# EAGLE design PCB_Reflow0xPIT (EAGLE 6.5.0)
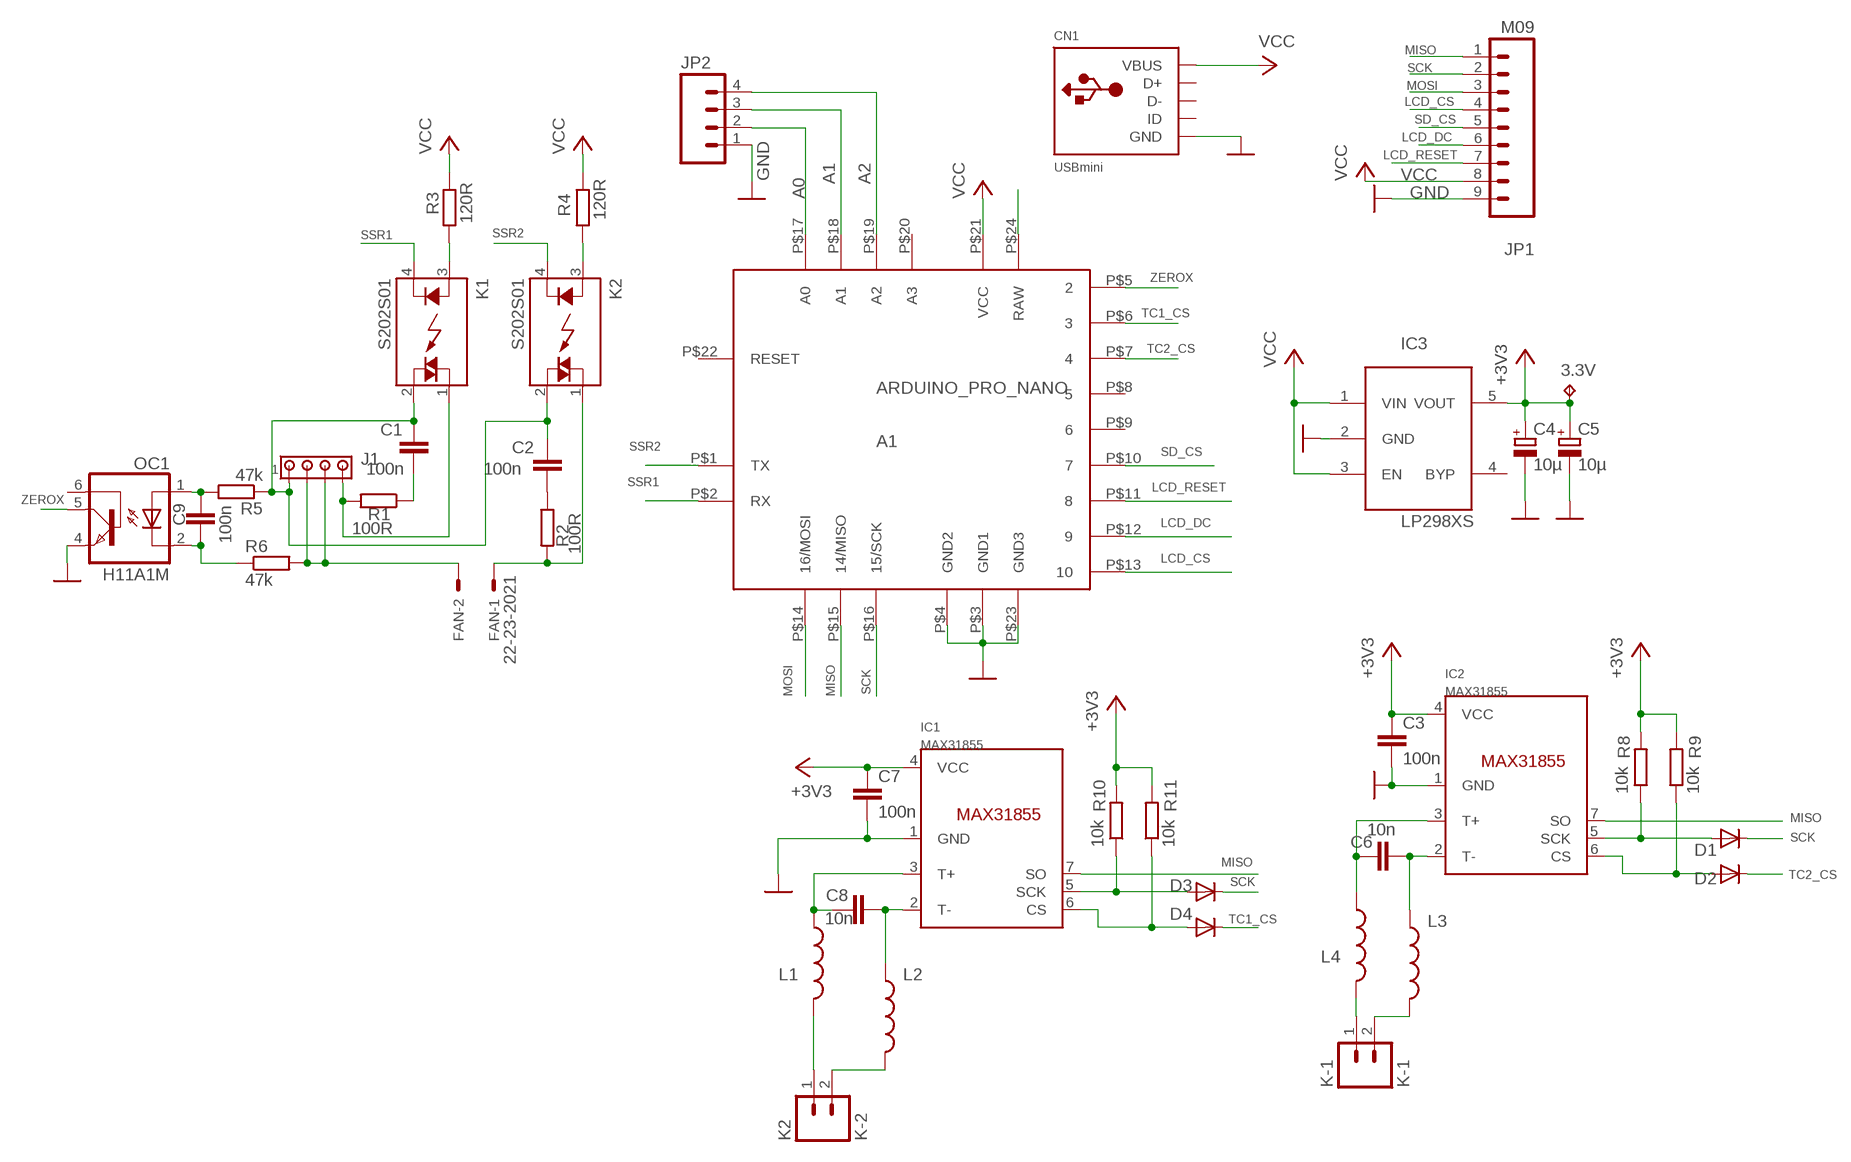
[diagram p0: schematic, sheet 1]

## Parts
3.3V  TPTP08R  [TP08R]
A1  ARDUINO_PRO_NANO  [ARDUINO_PRO_NANO]
C1  100n  C-EU102-043X133  [C102-043X133]
C2  100n  C-EU102-043X133  [C102-043X133]
C3  100n  C-EUC0805  [C0805]
C4  10µ  CPOL-EUC/6032-28R  [C/6032-28R]
C5  10µ  CPOL-EUC/6032-28R  [C/6032-28R]
C6  10n  C-EUC0603  [C0603]
C7  100n  C-EUC0805  [C0805]
C8  10n  C-EUC0603  [C0603]
C9  100n  C-EU025-025X050  [C025-025X050]
CN1  USBmini  USBMINIB  [USB-MINIB]
D1  1N4148  DIODESOD-123  [SOD-123]
D2  1N4148  DIODESOD-123  [SOD-123]
D3  1N4148  DIODESOD-123  [SOD-123]
D4  1N4148  DIODESOD-123  [SOD-123]
FAN  22-23-2021  [22-23-2021]
IC1  MAX31855  [SOIC8]
IC2  MAX31855  [SOIC8]
IC3  LP298XS  [SOT23-5L]
J1  MTA04-156  [1X4MTA]
JP1  M09  [1X09]
JP2  M04LOCK  [1X04_LOCK]
K1  S202S01  [S102S01]
K2  S202S01  [S102S01]
K-1  K-1  M02JST-PTH-2  [JST-2-PTH]
K-2  K2  M02JST-PTH-2  [JST-2-PTH]
L1  INDUCTOR0402  [C0402]
L2  INDUCTOR0402  [C0402]
L3  INDUCTOR0402  [C0402]
L4  INDUCTOR0402  [C0402]
OC1  H11A1M  [DIL06]
R1  100R  R-EU_0207/5V  [0207/5V]
R2  100R  R-EU_0207/5V  [0207/5V]
R3  120R  R-EU_M0805  [M0805]
R4  120R  R-EU_M0805  [M0805]
R5  47k  R-EU_0207/2V  [0207/2V]
R6  47k  R-EU_0207/2V  [0207/2V]
R8  10k  R-EU_M1206  [M1206]
R9  10k  R-EU_M1206  [M1206]
R10  10k  R-EU_M1206  [M1206]
R11  10k  R-EU_M1206  [M1206]

## Nets
+3V3: 3.3V.TP C3.1 C4.+ C5.+ C7.1 IC1.4(VCC) IC2.4(VCC) IC3.5(VOUT) R8.2 R9.2 R10.2 R11.2
A0: A1.P$17(A0) JP2.2
A1: A1.P$18(A1) JP2.3
A2: A1.P$19(A2) JP2.4
AC1: C1.1 C2.1 J1.1 K1.2(DS2) K2.2(DS2) R5.1
AC2: FAN.2 J1.2 J1.3 R6.2
AC_OUT1: J1.4 K1.1(DS1) R1.2
AC_OUT2: FAN.1 K2.1(DS1) R2.2
GND: A1.P$3(GND1) A1.P$4(GND2) A1.P$23(GND3) C3.2 C4.- C5.- C7.2 CN1.GND IC1.1(GND) IC2.1(GND) IC3.2(GND) JP1.9 JP2.1 OC1.4(EMI)
LCD_CS: A1.P$13 JP1.4
LCD_DC: A1.P$12 JP1.6
LCD_RESET: A1.P$11 JP1.7
MISO: A1.P$15(14/MISO) IC1.7(SO) IC2.7(SO) JP1.1
MOSI: A1.P$14(16/MOSI) JP1.3
N$1: C8.2 IC1.2(T-) L2.1
N$2: C6.2 IC2.2(T-) L3.1
N$3: C6.1 IC2.3(T+) L4.1
N$4: K-2.2 L2.2
N$5: K-2.1 L1.2
N$6: C1.2 R1.1
N$7: C2.2 R2.1
N$8: K-1.1 L4.2
N$9: C9.1 OC1.1(A) R5.2
N$10: C9.2 OC1.2(C) R6.1
N$11: C8.1 IC1.3(T+) L1.1
N$12: K-1.2 L3.2
N$13: K1.3(A) R3.2
N$14: K2.3(A) R4.2
N$15: D2.A IC2.6(CS) R9.1
N$16: D1.A IC2.5(SCK) R8.1
N$17: D4.A IC1.6(CS) R11.1
N$18: D3.A IC1.5(SCK) R10.1
RAW: A1.P$24(RAW)
SCK: A1.P$16(15/SCK) D1.C D3.C JP1.2
SD_CS: A1.P$10 JP1.5
SSR1: A1.P$2(RX) K1.4(K)
SSR2: A1.P$1(TX) K2.4(K)
TC1_CS: A1.P$6 D4.C
TC2_CS: A1.P$7 D2.C
VCC: A1.P$21(VCC) CN1.VBUS IC3.1(VIN) IC3.3(EN) JP1.8 R3.1 R4.1
ZEROX: A1.P$5 OC1.5(COL)
Unconnected: A1.P$8 A1.P$9 A1.P$20(A3) A1.P$22(RESET) CN1.D+ CN1.D- CN1.ID IC3.4(BYP) OC1.6(BAS)

## Library data of the parts
3.3V = testpad:TP: Test pad
A1 = pit:ARDUINO_PRO_NANO: SparkFun Arduino Pro Nano
C1-C3 C6-C9 = rcl:C-EU: CAPACITOR, European symbol
C4 C5 = rcl:CPOL-EU: POLARIZED CAPACITOR, European symbol
CN1 = microbuilder:USB: USB Connectors USBMINIB - Surface Mount Female Mini-B USB Connector 4UConnector: 06564
D1-D4 = adafruit:DIODE: Diode SMADIODE - SMA Surface Mount Package 20V 1A Schottky Diode Digikey: 641-1014-6-ND DO-1N4148 - Through Hole Small Current Diode SOD-123 20V 1 A (.5mV Vf) Schottky Diode - Digikey: MBRX120TPMSCT-ND SOD-323 10V 570mA (.38mV Vf, 3ns) Schottky Diode - Digikey: ZLLS410CT-ND SOD-523 30V 30mA Schottky Diode (RB751S-40TE61) - Digikey: RB751S-40TE61CT-ND SOT23-R/W - SOT23 Package (R = Solder Paste/Reflow Ovens, W = Hand-Soldering) BAT54Film 40V 300mA - Digikey: 497-7162-1-ND
FAN = con-molex:22-23-2021: .100" (2.54mm) Center Header - 2 Pin; MF: MOLEX; MPN: 22-23-2021; OC_FARNELL: 1462926; OC_NEWARK: 25C3832
IC1 IC2 = AlexW-Eagle-Libraries:MAX31855
IC3 = adafruit:LP298X
J1 = con-amp:MTA04-156: AMP connector
JP1 = ModernDevice:M09: Header 9 Standard 9-pin 0.1" header. Use with straight break away headers (SKU : PRT-00116), right angle break away headers (PRT-00553), swiss pins (PRT-00743), machine pins (PRT-00117), and female headers (PRT-00115).
JP2 = ModernDevicebak2:M04: Header 4 Standard 4-pin 0.1" header. Use with straight break away headers (SKU : PRT-00116), right angle break away headers (PRT-00553), swiss pins (PRT-00743), machine pins (PRT-00117), and female headers (PRT-00115). Molex polarized connector foot print use with SKU : PRT-08231 with associated crimp pins and housings.
K1 K2 = relay:S?*: Low Height Type Solid State Relays SHARP Source: 162574-da-01-en-S202T02_Solid_State_Relais.pdf Source: http://sharp-world.com .. s102s11_e.pdf; MPN: S202S01F; OC_FARNELL: 1618474; OC_NEWARK: 14N9587
K-1 K-2 = ModernDevice:M02: Header 2 Standard 2-pin 0.1" header. Use with straight break away headers (SKU : PRT-00116), right angle break away headers (PRT-00553), swiss pins (PRT-00743), machine pins (PRT-00117), and female headers (PRT-00115). Molex polarized connector foot print use with SKU : PRT-08233 with associated crimp pins and housings.
L1-L4 = SparkFun-Passives:INDUCTOR: Inductors Basic Inductor/Choke - 0603 and 1206. Footprints are not proven and vary greatly between part numbers.
OC1 = optocoupler:H11A*?M: General Purpose 6-Pin Phototransistor Optocouplers Source: http://www.fairchildsemi.com/ds/4N/4N35-M.pdf; MPN: H11A1-M; OC_FARNELL: 1021358; OC_NEWARK: 97K1793
R1-R6 R8-R11 = rcl:R-EU_: RESISTOR, European symbol

## Net classes
0 default: width 0.203 mm
1 vcc: width 0.254 mm

## Board
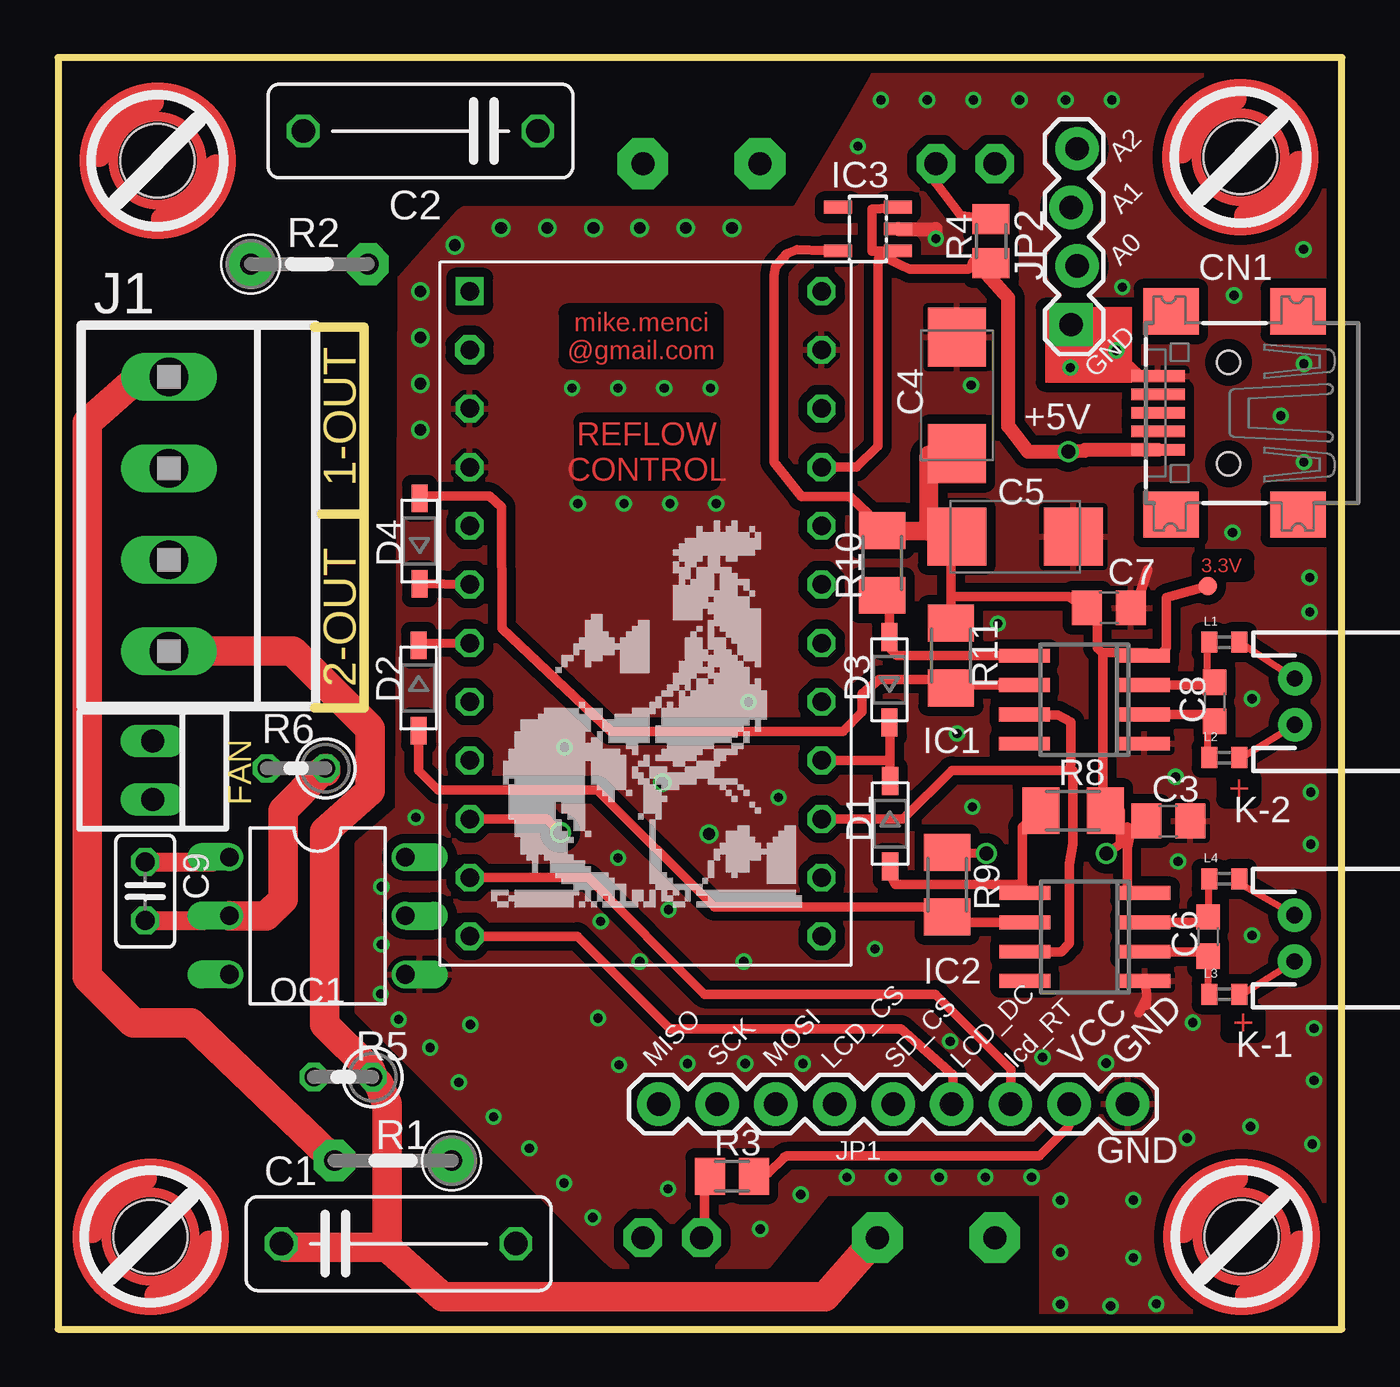
[diagram p1: board, top side]
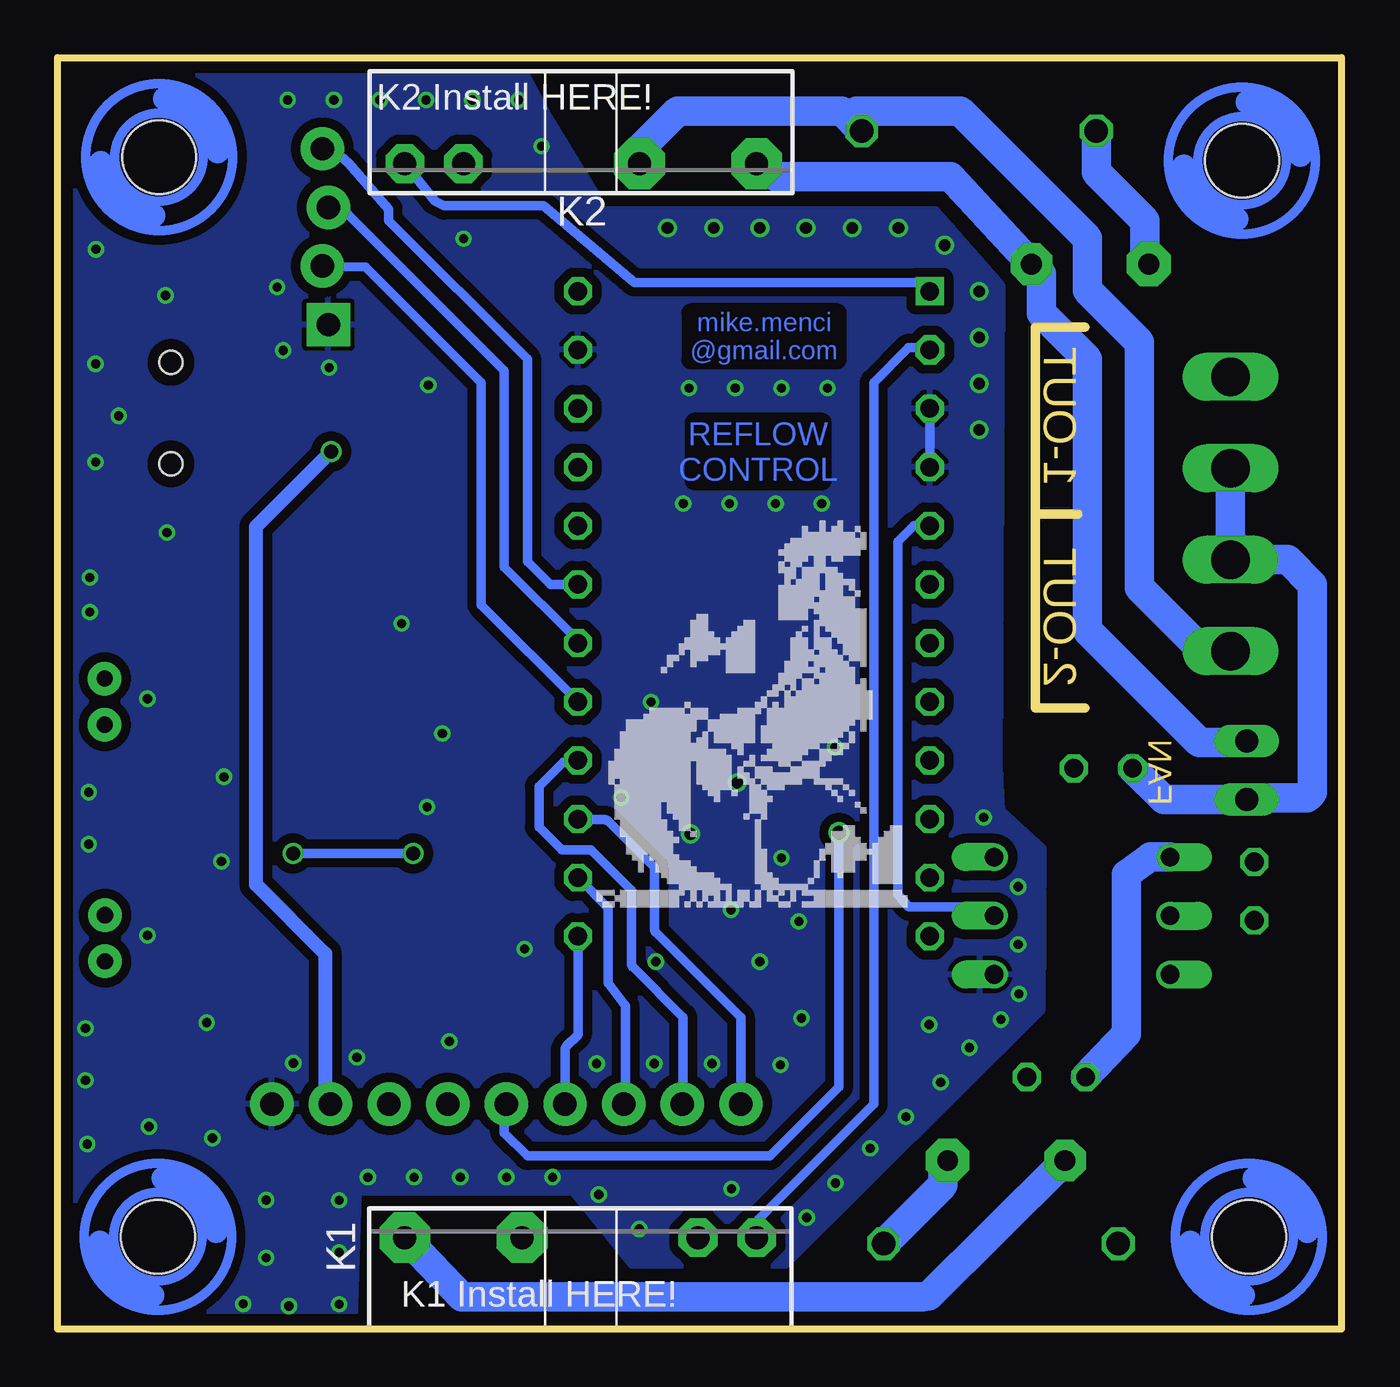
[diagram p2: board, bottom side, seen from below]

Size 55.59 x 55.06 mm. Coordinates in mm from the lower left corner, seen from the top.
Outline: 11.1,43.4 13.25,43.4 13.25,35.3
Outline: 11.4,35.3 13.25,35.3
Outline: 13.25,35.3 13.25,26.9 11.1,26.9
Outline: 0,0 55.59,0 55.59,55.06 0,55.06 0,0
Copper layers (1*16): Top 0.035mm / dielectric 1.5mm / Bottom 0.035mm
Design rules "multi-cb_035um-cu_en *": minimum track width 6mil, minimum drill 12mil, track to track 6mil, track to pad 6mil, pad to pad 6mil, via to via 6mil, smd to smd 6mil, copper to edge 20mil, drill to drill 8mil, minimum pad ring 8mil, minimum via ring 6mil, stop-mask expansion 3mil, vias tented up to drill 0mil, thermal gap 8mil

### Footprints (pad centres in the part's own frame; a part is rotated, then mirrored left to right if it is on the bottom)
TP08R = smd 0.8 x 0.8: TP 0,0
ARDUINO_PRO_NANO = drill 0.8 square: P$1 -7.62,13.97 | drill 0.8 pad 1.27 octagon: P$2 -7.62,11.43 | drill 0.8 octagon: P$3 -7.62,8.89; P$4 -7.62,6.35; P$5 -7.62,3.81; P$6 -7.62,1.27; P$7 -7.62,-1.27; P$8 -7.62,-3.81; P$9 -7.62,-6.35; P$10 -7.62,-8.89; P$11 -7.62,-11.43; P$12 -7.62,-13.97; P$13 7.62,-13.97; P$14 7.62,-11.43; P$15 7.62,-8.89; P$16 7.62,-6.35; P$17 7.62,-3.81; P$18 7.62,-1.27; P$19 7.62,1.27; P$20 7.62,3.81; P$21 7.62,6.35; P$22 7.62,8.89; P$23 7.62,11.43; P$24 7.62,13.97
C102-043X133 = drill 1.016 octagon: 1 -5.08,0; 2 5.08,0
C0805 = smd 1.3 x 1.5: 1 -0.95,0; 2 0.95,0
C/6032-28R = smd 2.55 x 2.5: + 2.525,0; - -2.525,0
C0603 = smd 1.1 x 1: 1 -0.85,0; 2 0.85,0
C025-025X050 = drill 0.813 octagon: 1 -1.27,0; 2 1.27,0
USB-MINIB = smd 0.5 x 2.308: D+ 0,4.064; D- -0.8,4.064; GND 1.6,4.064; ID 0.8,4.064; VBUS -1.6,4.064 | smd 2 x 2.4: GND1 -4.4,-2; GND2 -4.4,3.5; GND3 4.4,3.5; GND4 4.4,-2 | hole 1: -2.2,1; 2.2,1
SOD-123 = smd 1.2 x 0.7: A 1.85,0; C -1.85,0
22-23-2021 = drill 1 long: 1 -1.27,0; 2 1.27,0
SOIC8 = smd 0.6 x 2.2: 1 -1.905,-2.6; 2 -0.635,-2.6; 3 0.635,-2.6; 4 1.905,-2.6; 5 1.905,2.6; 6 0.635,2.6; 7 -0.635,2.6; 8 -1.905,2.6
SOT23-5L = smd 0.55 x 1.2: 1 -0.95,-1.3; 2 0,-1.3; 3 0.95,-1.3; 4 0.95,1.3; 5 -0.95,1.3
1X4MTA = drill 1.676 long: 1 5.944,0; 2 1.981,0; 3 -1.981,0; 4 -5.944,0
1X09 = drill 1.016 pad 1.88: 1 0,0; 2 2.54,0; 3 5.08,0; 4 7.62,0; 5 10.16,0; 6 12.7,0; 7 15.24,0; 8 17.78,0; 9 20.32,0
1X04_LOCK = drill 1.016 pad 1.88 square: 1 0,0.127 | drill 1.016 pad 1.88: 2 2.54,-0.127; 3 5.08,0.127; 4 7.62,-0.127
S102S01 = drill 1 pad 2.2 octagon: 1 -7.62,0; 2 -2.54,0 | drill 1 pad 1.676 octagon: 3 5.08,0; 4 7.62,0
JST-2-PTH = drill 0.7 pad 1.448: 1 -1,0; 2 1,0
C0402 = smd 0.7 x 0.9: 1 -0.65,0; 2 0.65,0
DIL06 = drill 0.813 offset: 1 -2.54,-3.81; 2 0,-3.81; 3 2.54,-3.81; 4 2.54,3.81; 5 0,3.81; 6 -2.54,3.81
0207/5V = drill 0.9 pad 1.9 octagon: 1 -2.54,0 | drill 0.9 pad 1.8 octagon: 2 2.54,0
M0805 = smd 1.3 x 1.6: 1 -0.95,0; 2 0.95,0
0207/2V = drill 0.813 octagon: 1 -1.27,0; 2 1.27,0
M1206 = smd 1.6 x 2: 1 -1.4,0; 2 1.4,0
SCREW-3 = hole 3.2: 0,0

### Placement (x,y rotation side)
3.3V  49.79,32.18 180 top
A1  25.44,30.98 0 top
C1  14.74,3.7 0 top
C2  15.69,51.89 180 top
C3  48.07,22 0 top
C4  38.92,40.44 270 top
C5  41.44,34.32 180 top
C6  49.8,17 270 top
C7  45.5,31.24 0 top
C8  50.08,27.17 270 top
C9  3.77,18.96 270 top
CN1  51.69,39.67 90 top
D1  36.03,21.89 270 top
D2  15.61,27.76 270 top
D3  36,28.12 90 top
D4  15.65,34.13 90 top
FAN  4.1,24.2 270 top
IC1  44.44,27.26 90 top
IC2  44.47,16.98 90 top
IC3  35.07,47.64 90 top
J1  4.8,35.3 270 top
JP1  26,9.75 0 top
JP2  44,43.5 90 top
K1  32.94,3.96 0 bottom
K2  32.94,50.47 180 bottom
K-1  53.55,16.93 270 top
K-2  53.56,27.17 270 top
L1  50.5,29.75 0 top
L2  50.5,24.75 0 top
L3  50.5,14.5 0 top
L4  50.5,19.5 0 top
OC1  11.23,17.9 270 top
R1  14.51,7.3 180 top
R2  10.88,46.12 0 top
R3  29.18,6.62 180 top
R4  40.4,47.11 90 top
R5  12.35,10.92 180 top
R6  10.31,24.29 180 top
R8  43.95,22.45 0 top
R9  38.5,19.25 90 top
R10  35.68,33.18 90 top
R11  38.66,29.17 90 top
U$1  [LOGOMM]  18.5,17.5 0 top
U$2  [LOGOMM]  32.5,17.5 0 bottom
U$7  [SCREW-3]  51.25,4 0 top
U$8  [SCREW-3]  4,4 0 top
U$9  [SCREW-3]  4.3,50.6 0 top
U$10  [SCREW-3]  51.2,50.75 0 top

### Tracks (layer width: path | path; a pad name or v marks a point on that pad's centre or on a via)
+3V3  (via drill 0.6)
  Top 0.406: R9.2 38.44,20.63 38.43,20.63 | 38.25,20.55 38.15,20.4 38.22,20.63 38.43,20.63 | 38.43,20.63 v40.2,20.6 | 46.3,20.85 46.42,21.35 C3.1 | 47.34,29.21 IC1.4 47.25,29.2 | C5.+ 38.75,34.25 38.66,34.16 38.66,31.71 | 38.66,31.71 R11.2 | IC3.5 32,46.75 31.57,46.57 31.07,46.01 31,45.62 31,37.55 32.18,36.05 34.28,36.05 35.1,35.3 35.1,34.57 R10.2 | IC2.4 46.27,18.88 46.3,19.1 46.3,20.85 | 38.66,31.71 43.78,31.71 C7.1 45,31.24 45,29.5 45.25,29.25 | 47.25,29.2 47.15,29.3 45.3,29.3 45.25,29.25 | 45.25,29.25 45.25,23.15 45.1,22.95 R8.2 46,22.45 46,21 | 3.3V.TP 48,31.68 48,29.5 47.75,29.25 47.25,29.2 | 46,21 46.3,21.75 46.3,20.85 | 46,21 v45.4,20.6
  Top 0.813: R10.2 37.65,34.56 C5.+ 38.1,34.4 37.72,34.78 37.72,37.86 C4.+
  Bottom 0.406: v40.2,20.6 v45.4,20.6
A0
  Bottom 0.406: JP2.2 43.52,46.02 42.25,46 37.25,41 37.25,31.36 A1.P$17
A1
  Bottom 0.406: A1.P$18 33.06,29.81 36.25,33 36.25,41.5 43,48.25 43.21,48.5 JP2.3
A2
  Bottom 0.406: A1.P$19 34.25,32.25 35.25,33.25 35.25,42 41.25,48 41.25,48.5 43,50.5 43.56,51 JP2.4
AC1
  Top 1.27: 14.25,3.55 14.25,9.75 13.87,10.63 R5.1 13.5,11.25 11.55,13.2 11.55,21.55 13.5,23.3 13.5,26 10.14,29.36 J1.1 | 14.25,3.55 9.85,3.55 C1.1 | 14.25,3.55 16.65,1.4 33.2,1.4 35.4,3.88 K1.2
  Bottom 1.27: K2.2 30.4,51.1 28.75,52.75 21.64,52.75 C2.1 20.77,52.52 21,52.75 16.5,52.75 11,47.25 11,45 8.75,42.75 8.75,32.11 6,29.36 J1.1
AC2
  Bottom 1.27: J1.3 J1.2 2.32,33.32 1.25,32.25 1.25,23.25 1.5,23 3.53,23 FAN.2 7.69,22.93 R6.2
AC_OUT1
  Top 1.27: R1.2 11.71,7.54 5.75,13.25 3.25,13.25 1.25,15.25 1.25,39.25 3.5,41.25 4.04,41.25 J1.4
  Bottom 1.27: K1.1 40.36,3.76 38.1,1.4 18.15,1.4 17.85,1.45 12.1,7.16 R1.2
AC_OUT2
  Bottom 0.406: 3.67,25.4 FAN.1
  Bottom 1.27: K2.1 24.67,50.07 24.5,49.9 16.93,49.9 R2.2 13,45.7 13,44 11,42 11,30.25 6.15,25.4 3.67,25.4
GND  (via drill 0.4 pad 0.61, 0.51)
  Top 0.406: IC2.1 47.16,14.47 | 47.16,14.47 47.13,14.02 | C7.2 46.74,31.49 47.2,32.9 | 47.16,14.47 47.16,14.36 46.8,13.7 | 43.96,41.36 43.95,43.35 45.75,42.5 46.25,41.85 46.8,41.35 CN1.GND
  Top 0.61: IC3.2 38,47.64 38,47.25
  Bottom 0.406: A1.P$3 A1.P$4
  other vias: 39.53,40.88 28.25,40.75 50.86,34.49 50.93,44.76 34.63,51.23 20.41,7.83 54.25,23.25 54.2,31.05 31.2,23.02 24.24,20.41 46.56,5.59 46.09,45.13 21.93,25.2 35.38,16.46 38.94,25.8 13.97,14.52 26.25,40.75 54.31,8.02 54.39,13.02 39.59,22.61 45.58,1 48.39,23.92 26.44,18.17 17.35,10.69 43.83,41.64 38.01,47.23 24.29,11.44 29.9,27.16 26.16,23.66 13.99,19.16 13.99,16.66 15.49,22.16 14.74,13.41 16.1,12.19 18.85,9.19 21.91,6.33 26.41,6.08 32.16,5.83 30.41,4.33 34.16,6.58 36.16,6.58 38.16,6.58 40.16,6.58 42.16,6.58 43.41,5.58 43.41,3.33 43.41,1.08 28.18,21.44 15.68,38.94 15.68,40.94 15.68,42.94 15.68,44.94 17.18,46.94 19.18,47.69 21.18,47.69 23.18,47.69 25.18,47.69 27.18,47.69 23.16,4.83 46.56,3.09 47.56,1.09 48.89,8.27 51.64,8.77 54.39,10.77 49.14,13.27 54.25,21 48.5,20.25 40.7,30.55 29.18,47.69 35.63,53.23 37.63,53.23 39.63,53.23 41.63,53.23 43.63,53.23 45.63,53.23 54.2,32.55 53.95,37.55 52.95,39.55 53.95,41.8 23.49,17.66 25.19,15.92 23.38,13.46 38.63,12.46 53.93,46.76 29.69,15.92 29.75,11.5 32.25,11.5 27.25,11.5 51.7,27.3 51.7,17.05 45.39,11.52 42.64,11.77 45.83,42.39 17.85,13.19 24.25,40.75 22.25,40.75 28.5,35.75 26.5,35.75 24.5,35.75 22.5,35.75
  pour Bottom (isolate 0.406): 14.81,24.32 14.7,22.5 12.9,20.85 12.95,13.79 24.05,2.75 30.75,2.75 33.3,5.9 42.55,5.9 42.75,-0.35 56.17,-0.35 56,54.25 56.1,55.3 35.8,55.35 34.3,52.5 32.15,49 32.25,49.07 32,48.5 17.55,48.5 14.7,45.25
  pour Top (isolate 0.406): 14.8,45.5 14.7,22.5 12.95,21 12.95,13.75 23.66,3.05 24.01,2.75 30.75,2.75 33.3,5.9 42.6,5.9 42.6,-0.35 56.17,-0.35 56.25,45 56.25,55.25 35.85,55.25 35.3,54.3 34.3,52.5 31.9,48.5 17.55,48.5 17.35,48.35
LCD_CS
  Bottom 0.406: A1.P$13 33.06,12.75 33.55,12.26 arc-45 33.62,12.09 JP1.4
LCD_DC
  Top 0.406: A1.P$12 22.49,17.01 26.5,13 36.5,13 38.75,11 38.75,9.76 arc45 38.77,9.75 JP1.6
LCD_RESET
  Top 0.406: A1.P$11 22.95,19.55 28,14.5 38,14.5 41.25,11.25 41.25,9.78 arc45 41.32,9.75 JP1.7
MISO
  Top 0.406: A1.P$15 36.59,22.09 38.7,24.2 43.8,24.2 | 43.8,24.2 43.95,24.2 43.95,21 43.8,20.15 43.8,16.7 43.44,16.34 IC2.7 | 43.8,24.2 43.85,24.5 43.85,26.3 43.3,26.6 42.11,26.6 IC1.7
  Bottom 0.406: A1.P$15 33.06,22.06 31.91,22.06 arc45 31.74,21.99 29.75,20 29.75,17.36 arc-45 29.68,17.18 26,13.5 26,10.04 25.9,9.79 arc-45 JP1.1
MOSI
  Bottom 0.406: A1.P$14 31.75,18.25 31.75,15 31,14 31,9.87 30.85,9.87 arc-45 31.03,9.8 JP1.3
N$1
  Top 0.305: L2.1 49.78,25 49.78,26.62
  Top 0.406: IC1.2 49.78,26.62 C8.2 50.23,26.17
N$2
  Top 0.305: L3.1 49.8,14.5 C6.2
  Top 0.406: IC2.2 49.61,16.34 C6.2 50.02,15.93
N$3
  Top 0.305: L4.1 49.8,19.25 C6.1
  Top 0.406: IC2.3 49.56,17.61 C6.1 49.88,17.93
N$4
  Top 0.305: L2.2 51.25,24.75 K-2.2
N$5
  Top 0.305: L1.2 K-2.1
N$6
  Bottom 1.27: C1.2 19.8,3.7 17.25,6.25 17.25,7.09 R1.1
N$7
  Bottom 1.27: C2.2 10.61,50.11 8.5,48 8.5,46.28 R2.1
N$8
  Top 0.305: L4.2 51.25,19.25 K-1.1
N$9
  Top 0.813: C9.1 6.73,20.23 6.6,20.3 6.96,20.3 OC1.1
  Bottom 1.27: OC1.1 8.26,20.44 9.3,19.7 9.3,12.79 R5.2
N$10
  Top 0.813: C9.2 6.29,17.7 6.9,17.9 OC1.2
  Top 1.27: OC1.2 9,17.9 9.75,18.6 9.75,22.45 11.37,24.11 11.58,24.15 R6.1
N$11
  Top 0.305: L1.1 49.75,29.5 49.75,27.89
  Top 0.406: IC1.3 49.75,27.89 49.95,27.89 C8.1 50.23,28.17
N$12
  Top 0.305: L3.2 51.25,14.5 K-1.2
N$13
  Top 0.406: R3.2 28.63,6.37 28,6.25 28,4.07 K1.3
N$14
  Top 0.406: R4.2 39.1,48.23 37.99,49.66 38,49.92 37.99,50.5 K2.3
N$15
  Top 0.406: IC2.6 38.11,17.61 38.32,17.83 R9.1 37.41,18.29 28.41,18.29 23.34,23.35 16.44,23.35 15.6,24.2 D2.A
N$16
  Top 0.406: 41.75,19.25 IC2.5 41.75,19 41.75,19.25 | 41.75,19.25 36.25,19.25 36,19.75 D1.A | R8.1 42.45,22.45 41.75,21.75 41.75,19.25
N$17
  Top 0.406: IC1.6 38.76,27.89 38.76,27.96 38.54,28.13 | 38.54,28.13 R11.1 | 38.54,28.13 35.54,28.13 34.8,27.5 34.81,26.72 33.99,25.88 23.95,25.88 19.23,30.35 19.2,35.6 18.68,36.07 15.95,36.07 D4.A 15.6,35.93
N$18
  Top 0.305: 36,31.42 35.47,31.95 35.1,31.74 R10.1
  Top 0.406: IC1.5 36.33,29.16 35.94,29.56 35.94,29.91 D3.A 36,31.75 35.68,31.75 R10.1
SCK
  Top 0.406: 36,23.77 D1.C 36.03,24.63 | D3.C 36.03,26.27 36.03,24.63 | A1.P$16 36.03,24.63
  Bottom 0.406: A1.P$16 33.06,24.56 33.69,24.56 34.75,23.5 34.75,21.75 33.75,20.75 32.5,20.75 30.75,19 30.75,15.86 arc-45 30.68,15.68 28.5,13.5 28.5,10.28 arc-45 28.43,9.85 28.51,9.76 arc45 JP1.2
SD_CS  (via drill 0.6)
  Top 0.406: A1.P$10 21.16,22.09 v21.75,21.5
  Bottom 0.406: v21.75,21.5 21.75,10.5 24.75,7.5 35.25,7.5 36.25,8.5 36.25,9.7 arc-45 36.12,9.75 JP1.5
SSR1
  Bottom 0.406: K1.4 25.25,4.75 20.25,9.75 20.25,41 18.75,42.5 17.91,42.5 A1.P$2
SSR2
  Bottom 0.406: A1.P$1 18,45 18,45.32 30.62,45.32 34.55,48.65 38.85,48.65 39.25,48.85 40.5,50.41 K2.4
TC1_CS
  Top 0.406: D4.C A1.P$6
TC2_CS
  Top 0.406: A1.P$7 17.7,29.71 15.9,29.7 D2.C
VCC  (via drill 0.6)
  Top 0.406: v43.75,38 43.9,38 | JP1.8 43.78,8.88 arc-45 43.71,8.71 42.5,7.5 31.6,7.5 arc45 31.43,7.43 30.75,6.75 30.36,6.75 arc45 30.18,6.68 R3.1 | R4.1 39.5,46 39.41,45.91 36.87,45.91 35.54,46.53 | 35.54,46.53 IC3.1 35.25,46.69 35.25,48.5 35.37,48.5 IC3.3 | A1.P$21 34.58,37.33 35.5,38.25 35.5,45.98 35.54,46.53
  Top 0.61: CN1.VBUS 44.48,38.07 44.5,38.05 v43.75,38 42,38 41.15,39.1 41.15,44.65 39.85,46.1 39.69,46.15 R4.1
  Bottom 0.61: JP1.8 44,9.97 44,16.25 47,19.25 47,34.75 v43.75,38
ZEROX
  Bottom 0.406: OC1.5 16.33,18.29 18.73,18.29 19.2,18.8 19.2,34.1 18.51,34.8 A1.P$5
(copper drawn outside any net)
  shapes: Top area x1

### Text on the board
Top: mike.menci / @gmail.com | REFLOW / CONTROL | + | +
Bottom: mike.menci / @gmail.com | REFLOW / CONTROL
Dimension: 1-OUT | 2-OUT
tNames: A2 | A1 | A0 | GND | +5V | MISO | SCK | MOSI | LCD_CS | SD_CS | LCD_DC | lcd_RT | VCC | GND | GND
bNames: K2 Install HERE! | K1 Install HERE!
tValues: Tent Vias! | Arduino Wee v1.3